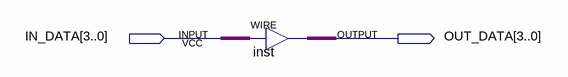
[diagram p0: schematic sheet]
// Quartus schematic slave.bdf as structural Verilog: 1 symbols, 2 pins
module slave (
  input  [3:0] IN_DATA,
  output [3:0] OUT_DATA
);

  assign OUT_DATA = IN_DATA;  // WIRE inst
endmodule
